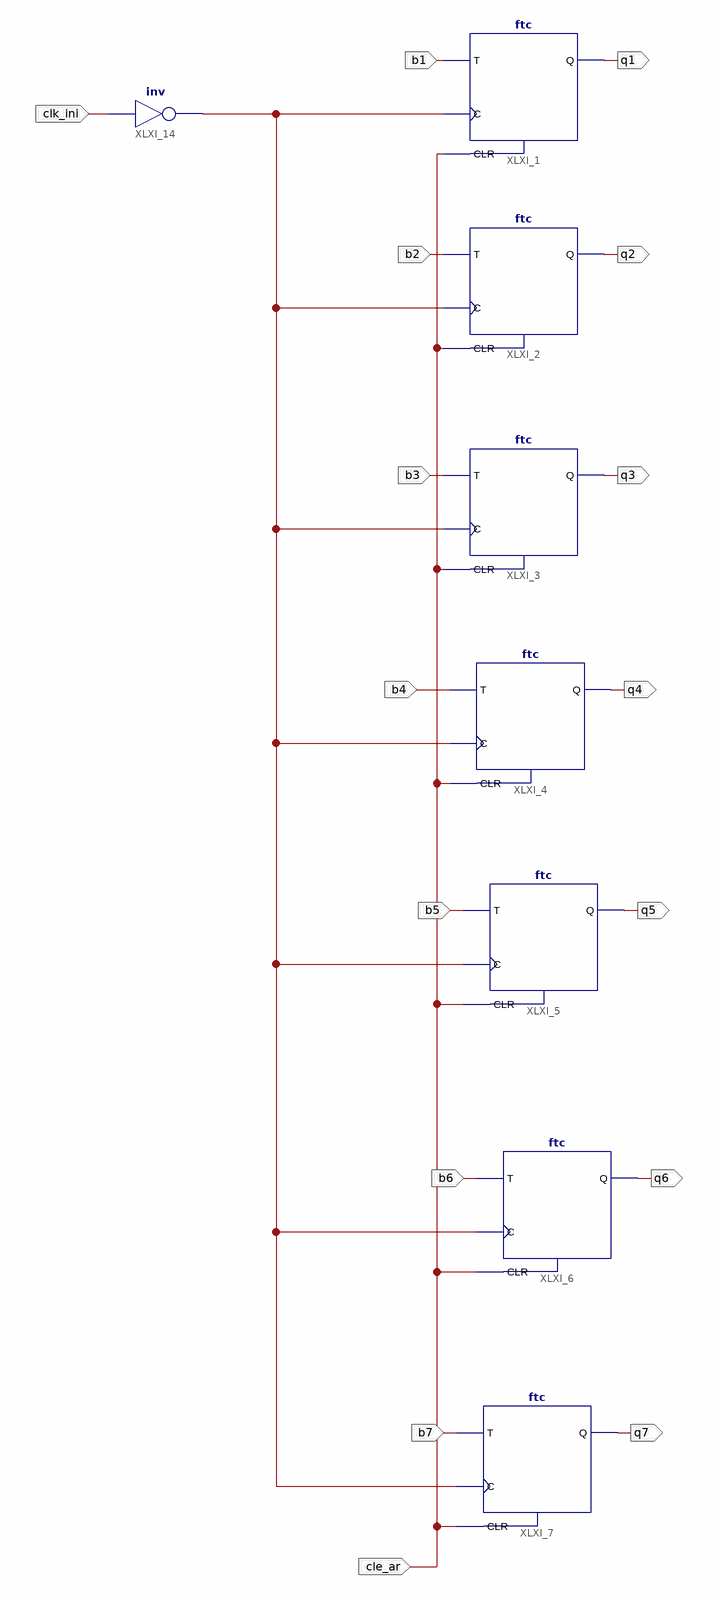
[diagram p0: schematic sheet 1]
// Xilinx ISE schematic bitCommand.sch (spartan6) as structural Verilog: 8 symbols, 16 ports
module bitCommand (
  input  cle_ar,
  input  b1,
  input  b3,
  input  b4,
  input  b5,
  input  b6,
  input  b7,
  input  b2,
  input  clk_ini,
  output q1,
  output q2,
  output q3,
  output q4,
  output q5,
  output q6,
  output q7
);

  wire cllk;

  ftc XLXI_1 (.C(cllk), .CLR(cle_ar), .T(b1), .Q(q1));
  ftc XLXI_2 (.C(cllk), .CLR(cle_ar), .T(b2), .Q(q2));
  ftc XLXI_3 (.C(cllk), .CLR(cle_ar), .T(b3), .Q(q3));
  ftc XLXI_4 (.C(cllk), .CLR(cle_ar), .T(b4), .Q(q4));
  ftc XLXI_5 (.C(cllk), .CLR(cle_ar), .T(b5), .Q(q5));
  ftc XLXI_6 (.C(cllk), .CLR(cle_ar), .T(b6), .Q(q6));
  ftc XLXI_7 (.C(cllk), .CLR(cle_ar), .T(b7), .Q(q7));
  not XLXI_14 (cllk, clk_ini);
endmodule
